# EAGLE schematic EngineeringModelBoard (EAGLE 7.3.0)

## Sheet 1 of 7: µC and Programming
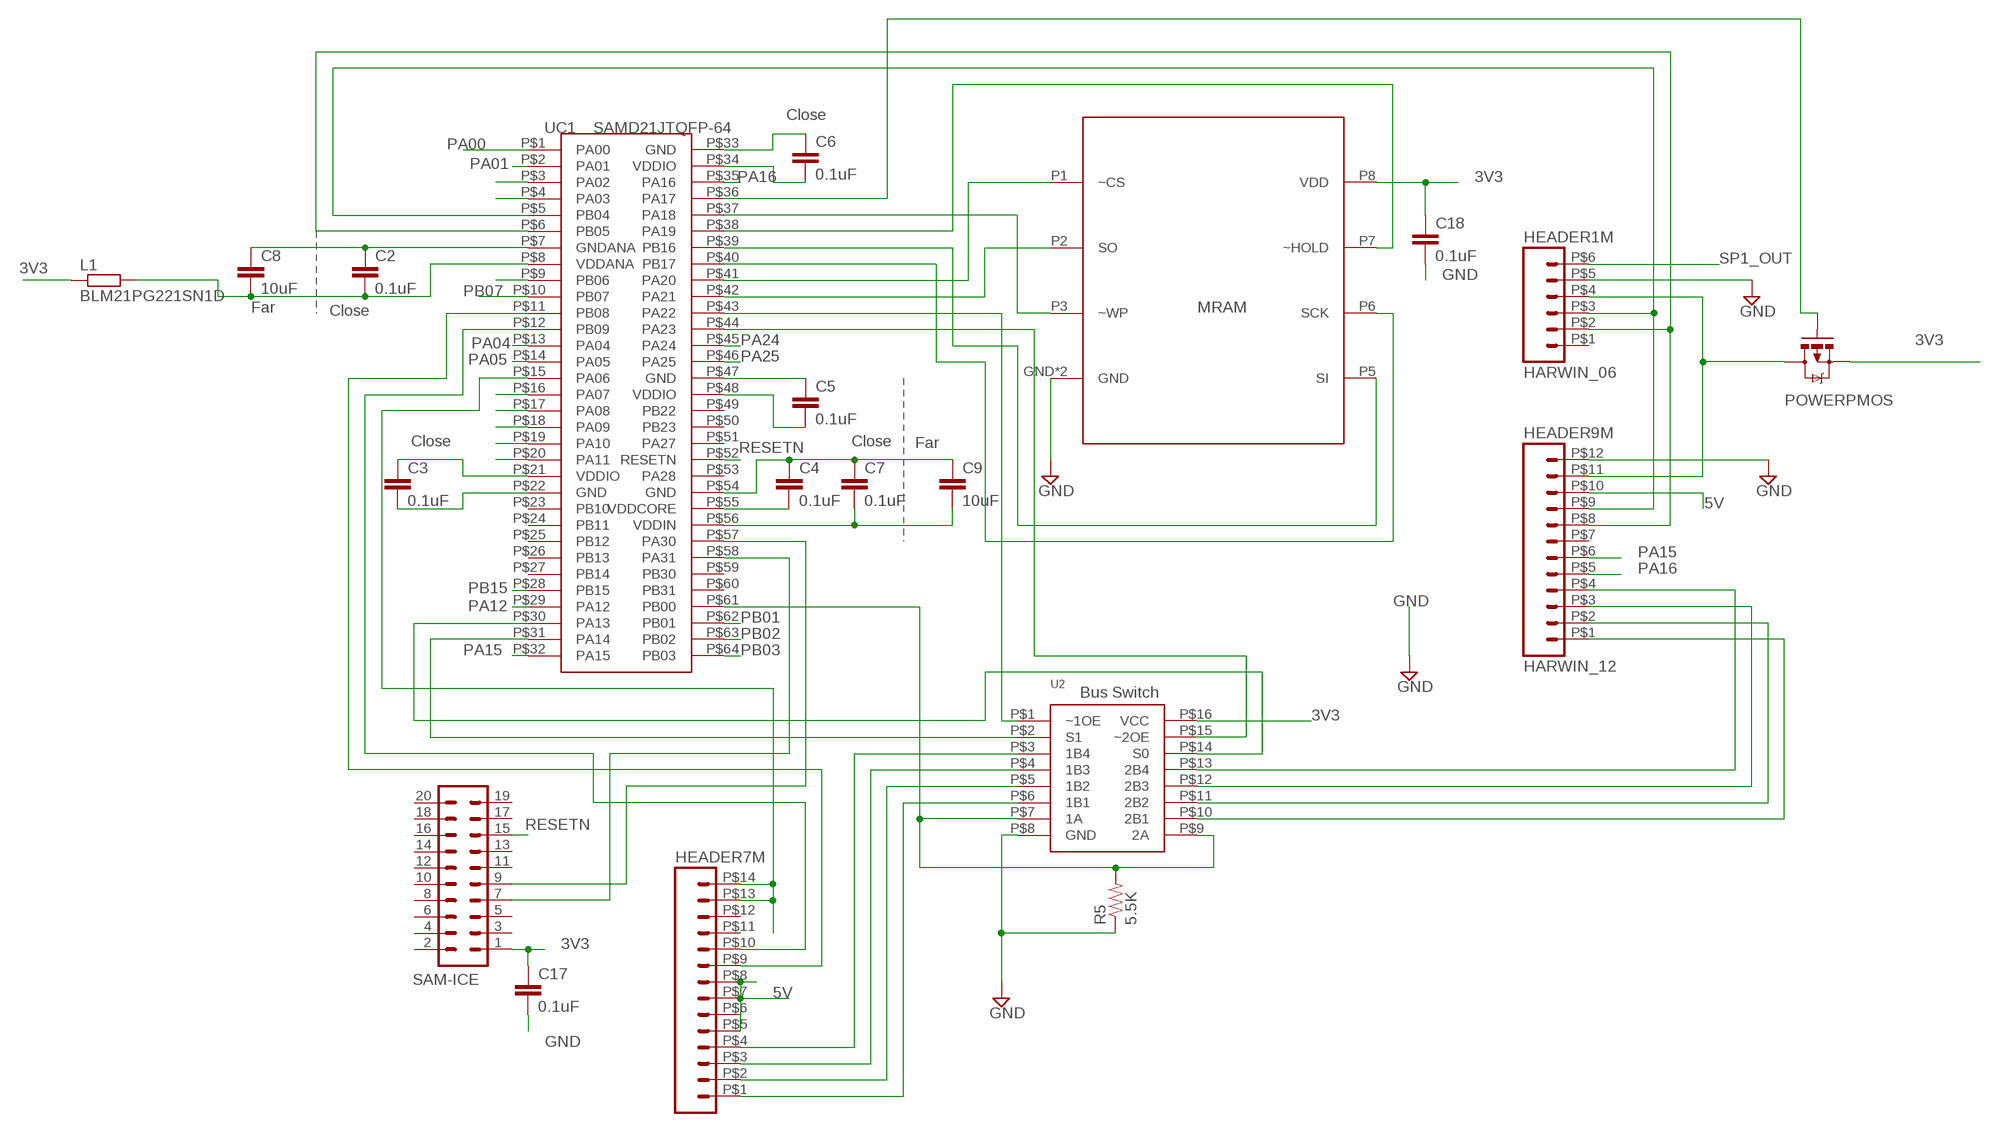
[diagram p0: schematic, sheet 1]

### Parts
C2  0.1uF  CAP0805  [0805]
C3  0.1uF  CAP0805  [0805]
C4  0.1uF  CAP0805  [0805]
C5  0.1uF  CAP0805  [0805]
C6  0.1uF  CAP0805  [0805]
C7  0.1uF  CAP0805  [0805]
C8  10uF  CAP0805  [0805]
C9  10uF  CAP0805  [0805]
C17  0.1uF  CAP0805  [0805]
C18  0.1uF  CAP0805  [0805]
HEADER1M  HARWIN_06  [HARWIN_DATAMATE_6]
HEADER7M  HARWIN_14  [HARWIN_DATAMATE_14]
HEADER9M  HARWIN_12  [HARWIN_DATAMATE_12]
L1  BLM21PG221SN1D  R-EU_R0805  [R0805]
R5  5.5K  RESISTOR  [0805]
SAM-ICE  IDC_JTAG_CONNECTOR  [2X10]
U2  SN74CBTLV3253  [SOIC16R]
U$3  MRAM  MR25H10CDC  [8PXMO-229]
U$14  POWERPMOS  [SO08]
UC1  SAMD21JTQFP-64  [TQFP-64]

### Nets
3V3 [3V3]: C3.1 C5.2 C6.2 C7.2 C9.2 C17.1 C18.1 L1.1 SAM-ICE.1 U2.P$16(VCC) U$3.P8(VDD) U$14.1(S) U$14.2(S) U$14.3(S) UC1.P$21(VDDIO) UC1.P$34(VDDIO) UC1.P$48(VDDIO) UC1.P$56(VDDIN) ; also sheet 4,5
3V3D [3V3]: HEADER1M.P$4 HEADER9M.P$11 U$14.5(D) U$14.6(D) U$14.7(D) U$14.8(D)
5V [5V]: HEADER7M.P$5 HEADER7M.P$6 HEADER7M.P$7 HEADER7M.P$8 HEADER9M.P$10 ; also sheet 4
GND [GND]: C2.1 C4.1 C5.1 C6.1 C7.1 C8.1 C9.1 C17.2 C18.2 HEADER1M.P$5 HEADER9M.P$12 R5.1 U2.P$8(GND) U$3.GND U$3.P4(GND) UC1.P$7(GNDANA) UC1.P$33(GND) UC1.P$47(GND) UC1.P$54(GND) ; also sheet 4,5,6
N$16: U$3.P1(~CS) UC1.P$41(PA20)
N$18: U$3.P2(SO) UC1.P$42(PA21)
N$19: U$3.P3(~WP) UC1.P$37(PA18)
N$20: HEADER9M.P$1 U2.P$10(2B1)
N$21: HEADER9M.P$2 U2.P$11(2B2)
N$22: HEADER9M.P$3 U2.P$12(2B3)
N$23: HEADER9M.P$4 U2.P$13(2B4)
N$24: HEADER7M.P$1 U2.P$6(1B1)
N$25: HEADER7M.P$2 U2.P$5(1B2)
N$26: HEADER7M.P$3 U2.P$4(1B3)
N$27: HEADER7M.P$4 U2.P$3(1B4)
N$28: U2.P$14(S0) UC1.P$30(PA13)
N$29: U2.P$2(S1) UC1.P$31(PA14)
N$30: U2.P$1(~1OE) UC1.P$43(PA22)
N$31: U2.P$15(~2OE) UC1.P$44(PA23)
N$34: U$3.P7(~HOLD) UC1.P$38(PA19)
N$35: U$3.P6(SCK) UC1.P$40(PB17)
N$41: C3.2 UC1.P$22(GND)
N$42: U$3.P5(SI) UC1.P$39(PB16)
N$43: C2.2 C8.2 L1.2 UC1.P$8(VDDANA)
N$47: C4.2 UC1.P$55(VDDCORE)
N$72: U$14.4(G) UC1.P$36(PA17)
PA00: UC1.P$1(PA00) ; also sheet 5
PA01: UC1.P$2(PA01) ; also sheet 5
PA02: UC1.P$3(PA02)
PA03: UC1.P$4(PA03)
PA04: UC1.P$13(PA04) ; also sheet 5
PA05: UC1.P$14(PA05) ; also sheet 5
PA06: HEADER7M.P$13 HEADER7M.P$14 UC1.P$15(PA06)
PA07: UC1.P$16(PA07)
PA08: UC1.P$17(PA08)
PA09: UC1.P$18(PA09)
PA10: UC1.P$19(PA10)
PA11: UC1.P$20(PA11)
PA12: UC1.P$29(PA12) ; also sheet 5
PA15: HEADER9M.P$6 UC1.P$32(PA15)
PA16: HEADER9M.P$5 UC1.P$35(PA16)
PA24: UC1.P$45(PA24) ; also sheet 6
PA25: UC1.P$46(PA25) ; also sheet 6
PA30: SAM-ICE.9 UC1.P$57(PA30)
PA31: SAM-ICE.7 UC1.P$58(PA31)
PB00: R5.2 U2.P$7(1A) U2.P$9(2A) UC1.P$61(PB00)
PB01: UC1.P$62(PB01) ; also sheet 6
PB02: UC1.P$63(PB02) ; also sheet 6
PB03: UC1.P$64(PB03) ; also sheet 6
PB04: HEADER1M.P$3 HEADER9M.P$9 UC1.P$5(PB04)
PB05: HEADER1M.P$2 HEADER9M.P$8 UC1.P$6(PB05)
PB06: UC1.P$9(PB06)
PB07: UC1.P$10(PB07) ; also sheet 4
PB08: HEADER7M.P$9 UC1.P$11(PB08)
PB09: HEADER7M.P$10 UC1.P$12(PB09)
PB15: UC1.P$28(PB15) ; also sheet 5
RESETN: SAM-ICE.15 UC1.P$52(RESETN)
SP1_OUT: HEADER1M.P$6
Unconnected: HEADER1M.P$1 HEADER7M.P$11 HEADER7M.P$12 HEADER9M.P$7 SAM-ICE.2 SAM-ICE.3 SAM-ICE.4 SAM-ICE.5 SAM-ICE.6 SAM-ICE.8 SAM-ICE.10 SAM-ICE.11 SAM-ICE.12 SAM-ICE.13 SAM-ICE.14 SAM-ICE.16 SAM-ICE.17 SAM-ICE.18 SAM-ICE.19 SAM-ICE.20 UC1.P$23(PB10) UC1.P$24(PB11) UC1.P$25(PB12) UC1.P$26(PB13) UC1.P$27(PB14) UC1.P$49(PB22) UC1.P$50(PB23) UC1.P$51(PA27) UC1.P$53(PA28) UC1.P$59(PB30) UC1.P$60(PB31)

### Notes on the sheet
- Close
- Far | Close | MRAM
- Close | Close | Far
- Bus Switch

## Sheet 2 of 7: Flash Panel
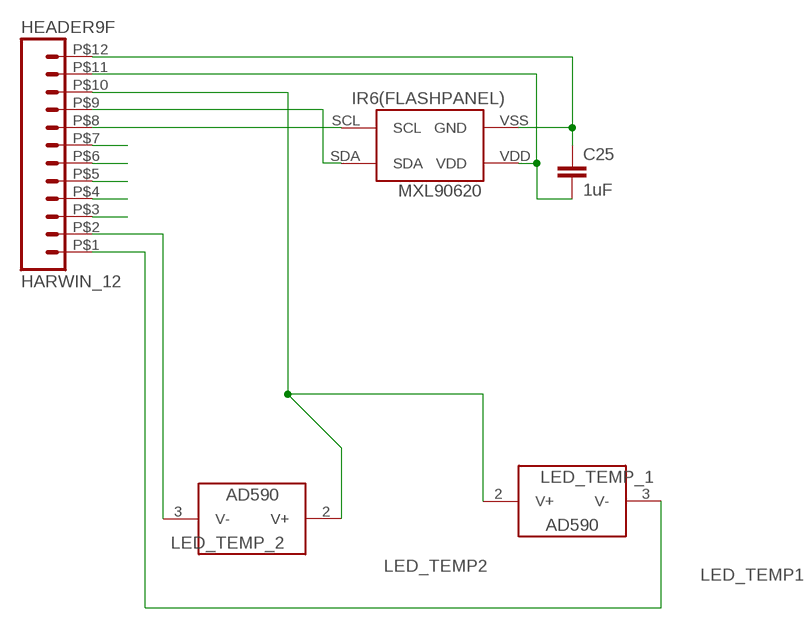
[diagram p1: schematic, sheet 2]

### Parts
C25  1uF  CAP0805  [0805]
HEADER9F  HARWIN_12  [HARWIN_DATAMATE_12]
IR6(FLASHPANEL)  MXL90620  [MXL90620]
LED_TEMP_1  AD590-SOIC-8  [8SOIC]
LED_TEMP_2  AD590-SOIC-8  [8SOIC]

### Nets
3V3IR: C25.2 HEADER9F.P$11 IR6(FLASHPANEL).VDD
GNDIR: C25.1 HEADER9F.P$12 IR6(FLASHPANEL).VSS(GND)
H9.1: HEADER9F.P$1 LED_TEMP_1.3(V-)
H9.2: HEADER9F.P$2 LED_TEMP_2.3(V-)
H9.3: HEADER9F.P$3
H9.4: HEADER9F.P$4
H9.5: HEADER9F.P$5
H9.6: HEADER9F.P$6
H9.7: HEADER9F.P$7
H9.10: HEADER9F.P$10 LED_TEMP_1.2(V+) LED_TEMP_2.2(V+)
SCLIR: HEADER9F.P$8 IR6(FLASHPANEL).SCL
SDAIR: HEADER9F.P$9 IR6(FLASHPANEL).SDA

### Notes on the sheet
- LED_TEMP2
- LED_TEMP1

## Sheet 3 of 7: Side 1
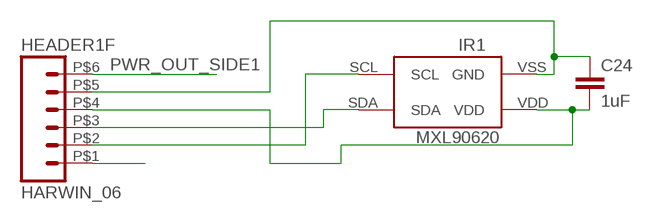
[diagram p2: schematic, sheet 3]

### Parts
C24  1uF  CAP0805  [0805]
HEADER1F  HARWIN_06  [HARWIN_DATAMATE_6]
IR1  MXL90620  [MXL90620]

### Nets
H1.1: HEADER1F.P$1
H1.2: HEADER1F.P$2 IR1.SCL
H1.3: HEADER1F.P$3 IR1.SDA
H1.4: C24.2 HEADER1F.P$4 IR1.VDD
H1.5: C24.1 HEADER1F.P$5 IR1.VSS(GND)
PWR_OUT_SIDE1: HEADER1F.P$6

## Sheet 4 of 7: Power Regulation
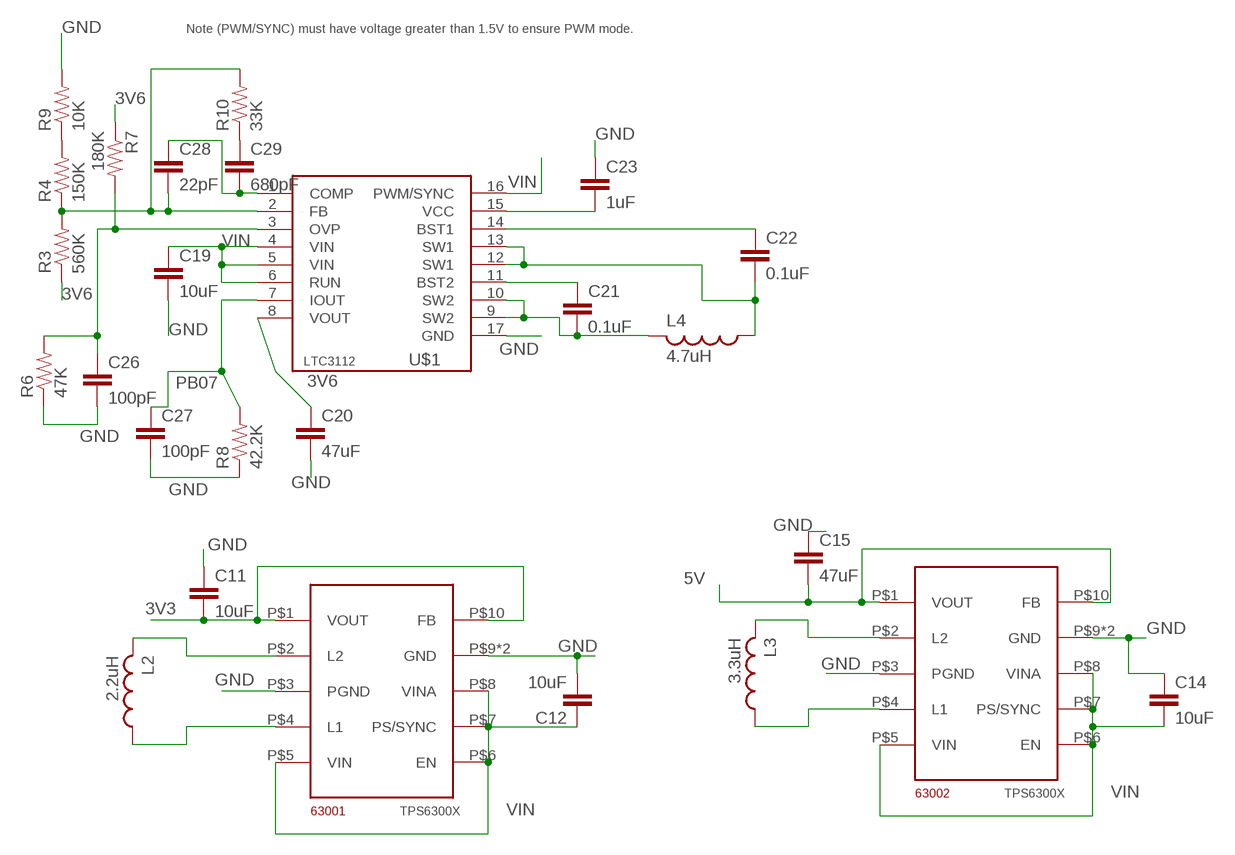
[diagram p3: schematic, sheet 4]

### Parts
63001  TPS6300X  [QFN10_POWERPAD]
63002  TPS6300X  [QFN10_POWERPAD]
C11  10uF  CAP0603-CAP  [0603-CAP]
C12  10uF  CAP0603-CAP  [0603-CAP]
C14  10uF  CAP0603-CAP  [0603-CAP]
C15  47uF  CAP0603-CAP  [0603-CAP]
C19  10uF  CAP0603-CAP  [0603-CAP]
C20  47uF  CAP0805  [0805]
C21  0.1uF  CAP0603-CAP  [0603-CAP]
C22  0.1uF  CAP0603-CAP  [0603-CAP]
C23  1uF  CAP0603-CAP  [0603-CAP]
C26  100pF  CAP0805  [0805]
C27  100pF  CAP0805  [0805]
C28  22pF  CAP0805  [0805]
C29  680pF  CAP0805  [0805]
L2  2.2uH  L-USL3225M  [L3225M]
L3  3.3uH  L-USL3225M  [L3225M]
L4  4.7uH  L-USL3225M  [L3225M]
R3  560K  RESISTOR  [0805]
R4  150K  RESISTOR  [0805]
R6  47K  RESISTOR  [0805]
R7  180K  RESISTOR  [0805]
R8  42.2K  RESISTOR  [0805]
R9  10K  RESISTOR  [0805]
R10  33K  RESISTOR  [0805]
U$1  LTC3112  [DHD16]

### Nets
3V3 [3V3]: 63001.P$1(VOUT) 63001.P$10(FB) C11.2 ; also sheet 1,5
3V6 [3V6]: C20.1 R3.1 R7.1 U$1.8(VOUT) ; also sheet 6
5V [5V]: 63002.P$1(VOUT) 63002.P$10(FB) C15.2 ; also sheet 1
GND [GND]: 63001.P$3(PGND) 63001.P$9(GND) 63001.PAD(GND) 63002.P$3(PGND) 63002.P$9(GND) 63002.PAD(GND) C11.1 C12.2 C14.1 C15.1 C19.2 C20.2 C23.1 C26.2 C27.2 R6.1 R8.1 R9.2 U$1.17(GND) ; also sheet 1,5,6
N$3: C21.1 U$1.11(BST2)
N$4: C22.1 U$1.14(BST1)
N$5: C23.2 U$1.15(VCC)
N$40: C22.2 L4.1 U$1.12(SW1) U$1.13(SW1)
N$45: 63002.P$2(L2) L3.2
N$46: 63002.P$4(L1) L3.1
N$48: 63001.P$2(L2) L2.2
N$50: 63001.P$4(L1) L2.1
N$53: C21.2 L4.2 U$1.9(SW2) U$1.10(SW2)
N$54: C28.2 R3.2 R4.1 R10.2 U$1.2(FB)
N$69: C26.1 R6.2 R7.2 U$1.3(OVP)
N$70: C29.1 R10.1
N$71: C28.1 C29.2 U$1.1(COMP)
N$999: R4.2 R9.1
PB07: C27.1 R8.2 U$1.7(IOUT) ; also sheet 1
VIN: 63001.P$5(VIN) 63001.P$6(EN) 63001.P$7(PS/SYNC) 63001.P$8(VINA) 63002.P$5(VIN) 63002.P$6(EN) 63002.P$7(PS/SYNC) 63002.P$8(VINA) C12.1 C14.2 C19.1 U$1.4(VIN) U$1.5(VIN) U$1.6(RUN) U$1.16(PWM/SYNC) ; also sheet 5

### Notes on the sheet
- Note (PWM/SYNC) must have voltage greater than 1.5V to ensure PWM mode.

## Sheet 5 of 7: Sensors
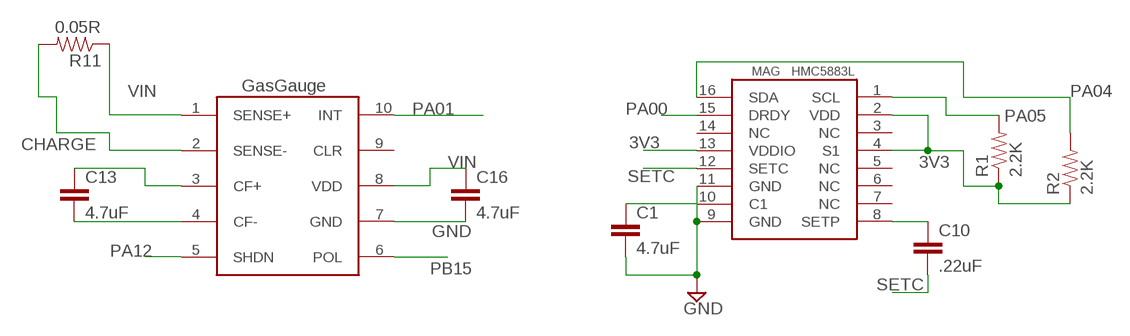
[diagram p4: schematic, sheet 5]

### Parts
C1  4.7uF  CAP0805  [0805]
C10  .22uF  CAP0805  [0805]
C13  4.7uF  CAP0805  [0805]
C16  4.7uF  CAP0805  [0805]
MAG  HMC5883L  [HMC5883L]
R1  2.2K  RESISTOR  [0805]
R2  2.2K  RESISTOR  [0805]
R11  0.05R  RESISTOR  [0805]
U$2  LTC4150  [MSOP10]

### Nets
3V3 [3V3]: MAG.2(VDD) MAG.4(S1) MAG.13(VDDIO) R1.1 R2.1 ; also sheet 1,4
CHARGE: R11.2 U$2.2(SENSE-)
GND [GND]: C1.2 C16.2 MAG.9(GND) MAG.11(GND) U$2.7(GND) ; also sheet 1,4,6
N$1: C1.1 MAG.10(C1)
N$36: C10.1 MAG.8(SETP)
N$57: C13.1 U$2.3(CF+)
N$58: C13.2 U$2.4(CF-)
PA00: MAG.15(DRDY) ; also sheet 1
PA01: U$2.10(INT) ; also sheet 1
PA04: MAG.16(SDA) R2.2 ; also sheet 1
PA05: MAG.1(SCL) R1.2 ; also sheet 1
PA12: U$2.5(SHDN) ; also sheet 1
PB15: U$2.6(POL) ; also sheet 1
SETC: C10.2 MAG.12(SETC)
VIN: C16.1 R11.1 U$2.1(SENSE+) U$2.8(VDD) ; also sheet 4
Unconnected: MAG.3(NC) MAG.5(NC) MAG.6(NC) MAG.7(NC) MAG.14(NC) U$2.9(CLR)

### Notes on the sheet
- GasGauge

## Sheet 6 of 7: Radio
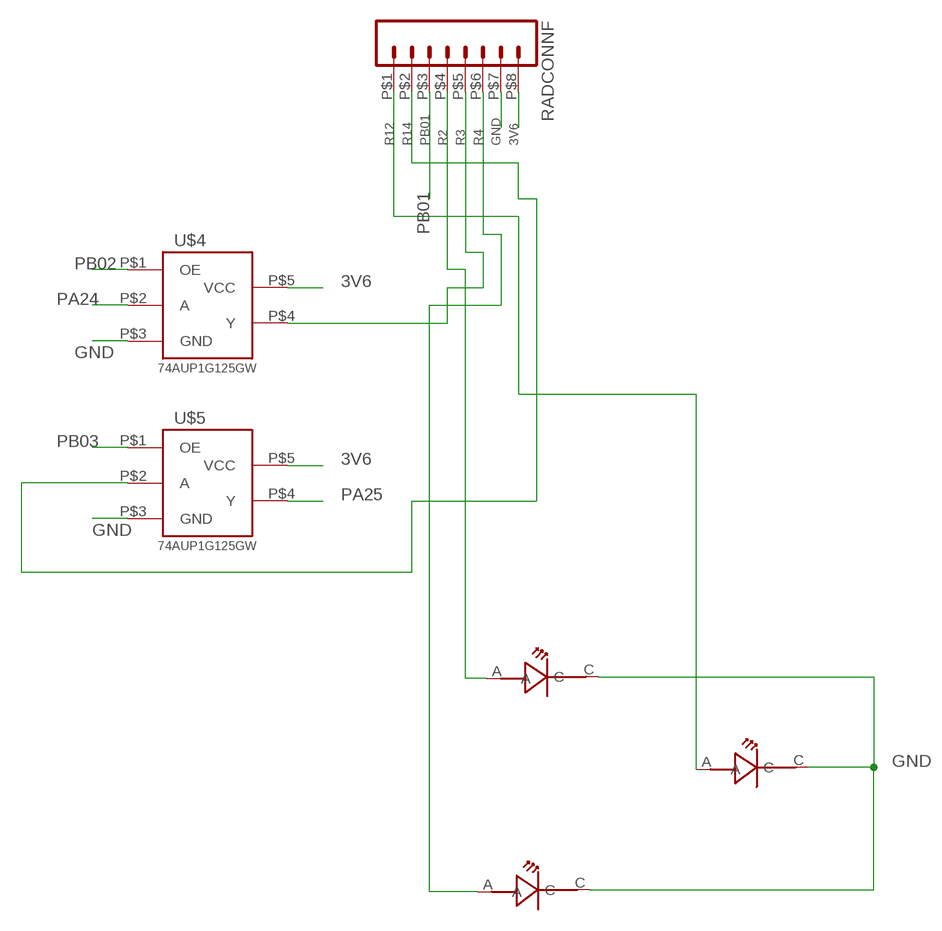
[diagram p5: schematic, sheet 6]

### Parts
RADCONNF  HARWIN_08  [HARWIN_DATAMATE_08]
U$4  74AUP1G125GW  [TSSOP-5]
U$5  74AUP1G125GW  [TSSOP-5]
U$11  LT-T673-Q1R2-25-Z  [PLCC-2]
U$12  LT-T673-Q1R2-25-Z  [PLCC-2]
U$13  LT-T673-Q1R2-25-Z  [PLCC-2]

### Nets
3V6 [3V6]: RADCONNF.P$8 U$4.P$5(VCC) U$5.P$5(VCC) ; also sheet 4
GND [GND]: RADCONNF.P$7 U$4.P$3(GND) U$5.P$3(GND) U$11.C U$12.C U$13.C ; also sheet 1,4,5
PA24: U$4.P$2(A) ; also sheet 1
PA25: U$5.P$4(Y) ; also sheet 1
PB01: RADCONNF.P$3 ; also sheet 1
PB02: U$4.P$1(OE) ; also sheet 1
PB03: U$5.P$1(OE) ; also sheet 1
R2: RADCONNF.P$4 U$13.A
R3: RADCONNF.P$5 U$4.P$4(Y)
R4: RADCONNF.P$6 U$12.A
R12: RADCONNF.P$1 U$11.A
R14: RADCONNF.P$2 U$5.P$2(A)

## Sheet 7 of 7: Batteries
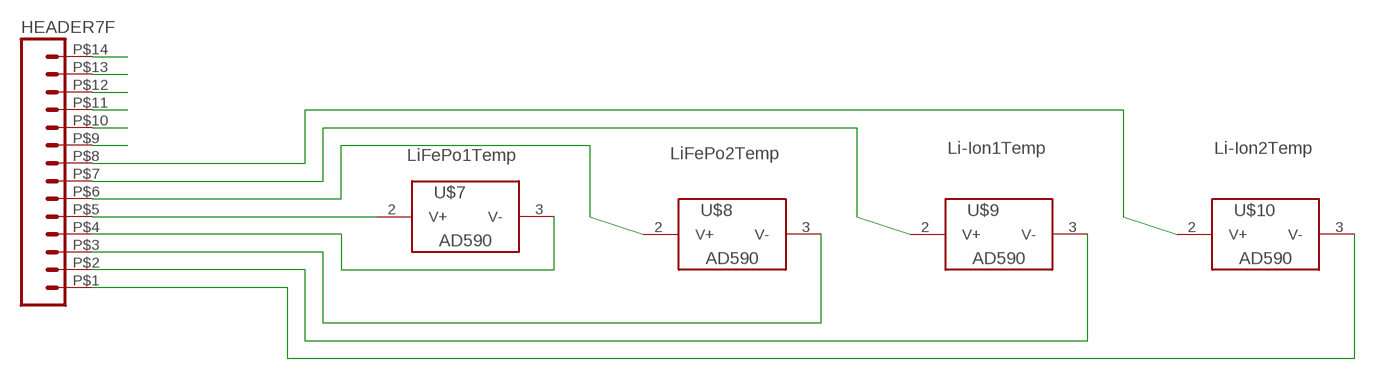
[diagram p6: schematic, sheet 7]

### Parts
HEADER7F  HARWIN_14  [HARWIN_DATAMATE_14]
U$7  AD590-SOIC-8  [8SOIC]
U$8  AD590-SOIC-8  [8SOIC]
U$9  AD590-SOIC-8  [8SOIC]
U$10  AD590-SOIC-8  [8SOIC]

### Nets
H7.1: HEADER7F.P$1 U$10.3(V-)
H7.2: HEADER7F.P$2 U$9.3(V-)
H7.3: HEADER7F.P$3 U$8.3(V-)
H7.4: HEADER7F.P$4 U$7.3(V-)
H7.5: HEADER7F.P$5 U$7.2(V+)
H7.6: HEADER7F.P$6 U$8.2(V+)
H7.7: HEADER7F.P$7 U$9.2(V+)
H7.8: HEADER7F.P$8 U$10.2(V+)
H7.9: HEADER7F.P$9
H7.10: HEADER7F.P$10
H7.11: HEADER7F.P$11
H7.12: HEADER7F.P$12
H7.13: HEADER7F.P$13
H7.14: HEADER7F.P$14

### Notes on the sheet
- Li-Ion1Temp | Li-Ion2Temp
- LiFePo1Temp | LiFePo2Temp

## Library data of the parts
63001 63002 = CNTRL_BOARD:TPS6300X; OC_NEWARK: unknown
C1 C13 C16 = CNTRL_BOARD:CAP: Capacitor Standard 0603 ceramic capacitor, and 0.1" leaded capacitor.; MF: AVX CORPORATION; MPN: 08056D475KAT2A; OC_NEWARK: 84K8400
C2-C7 C17 C18 C21 C22 = CNTRL_BOARD:CAP: Capacitor Standard 0603 ceramic capacitor, and 0.1" leaded capacitor.; MPN: 0603YC104JAT2A; OC_NEWARK: 96M1175
C8 C9 = CNTRL_BOARD:CAP: Capacitor Standard 0603 ceramic capacitor, and 0.1" leaded capacitor.; MF: AVX CORPORATION; MPN: 08056D106KAT2A; OC_NEWARK: 84K8398
C10 = CNTRL_BOARD:CAP: Capacitor Standard 0603 ceramic capacitor, and 0.1" leaded capacitor.; MF: AVX CORPORATION; MPN: 08053C224KAT2A; OC_NEWARK: 96K4775
C11 C12 C19 C23 = CNTRL_BOARD:CAP: Capacitor Standard 0603 ceramic capacitor, and 0.1" leaded capacitor.; OC_NEWARK: unknown
C14 = CNTRL_BOARD:CAP: Capacitor Standard 0603 ceramic capacitor, and 0.1" leaded capacitor.; MPN: C1608X5R1A225K080AC; OC_NEWARK: 04X3244
C15 C20 = CNTRL_BOARD:CAP: Capacitor Standard 0603 ceramic capacitor, and 0.1" leaded capacitor.; MPN: EMK107B7474KA-T; OC_NEWARK: 77M8434
C24 C25 = CNTRL_BOARD:CAP: Capacitor Standard 0603 ceramic capacitor, and 0.1" leaded capacitor.; MPN: 0805ZC105KAT2A; OC_NEWARK: 96M1308
C26 C27 = CNTRL_BOARD:CAP: Capacitor Standard 0603 ceramic capacitor, and 0.1" leaded capacitor.; MF: AVX CORPORATION; MPN: 08051A101J4T4A; OC_NEWARK: 55J5675
C28 = CNTRL_BOARD:CAP: Capacitor Standard 0603 ceramic capacitor, and 0.1" leaded capacitor.; MF: AVX CORPORATION; MPN: 08051A220JAT2A; OC_NEWARK: 96K4769
C29 = CNTRL_BOARD:CAP: Capacitor Standard 0603 ceramic capacitor, and 0.1" leaded capacitor.; MPN: 08055C681KAT2A; OC_NEWARK: 94W2947
HEADER1F HEADER1M = CNTRL_BOARD:HARWIN_06; OC_NEWARK: unknown
HEADER7F HEADER7M = CNTRL_BOARD:HARWIN_14; OC_NEWARK: unknown
HEADER9F HEADER9M = CNTRL_BOARD:HARWIN_12; OC_NEWARK: unknown
IR1 IR6(FLASHPANEL) = CNTRL_BOARD:MXL90620; OC_NEWARK: unknown
L1 = rcl:R-EU_: RESISTOR, European symbol; MPN: BLM21PG221SN1D; OC_NEWARK: 73M9167
L2 L4 = resistor:L-US: INDUCTOR, American symbol; OC_NEWARK: unknown
L3 = resistor:L-US: INDUCTOR, American symbol; MPN: JMK212BJ335KG-T; OC_NEWARK: 08P5148
LED_TEMP_1 LED_TEMP_2 U$7-U$10 = CNTRL_BOARD:AD590-SOIC-8; MPN: AD590JRZ; OC_NEWARK: 29M8422
MAG = CNTRL_BOARD:HMC5883L; MPN: HMC5883L-TR; OC_NEWARK: 20T0699
R1 R2 = CNTRL_BOARD:RESISTOR; MPN: SR1-0805-222; OC_NEWARK: 33C6600
R3 = CNTRL_BOARD:RESISTOR; MPN: MC01W08051560K; OC_NEWARK: 94W6326
R4-R6 R8-R11 = CNTRL_BOARD:RESISTOR; OC_NEWARK: unknown
R7 = CNTRL_BOARD:RESISTOR; MPN: ERJ-6GEYJ184V; OC_NEWARK: 53W4944
RADCONNF = CNTRL_BOARD:HARWIN_08; OC_NEWARK: unknown
SAM-ICE = CNTRL_BOARD:IDC_JTAG_CONNECTOR; OC_NEWARK: unknown
U2 = CNTRL_BOARD:SN74CBTLV3253; OC_NEWARK: unknown
U$1 = CNTRL_BOARD:LTC3112; MPN: LTC3112EFE#PBF; OC_NEWARK: 24T2752
U$2 = linear-technology:LTC4150; MPN: LTC4150CMS#PBF; OC_NEWARK: 56M8728
U$3 = mram:MR25H10CDC; OC_NEWARK: unknown
U$4 U$5 = CNTRL_BOARD:74AUP1G125GW; MPN: 74AUP1G125GW; OC_NEWARK: 55W4620
U$11-U$13 = CNTRL_BOARD:LT-T673-Q1R2-25-Z; OC_NEWARK: unknown
U$14 = CNTRL_BOARD:POWERPMOS; OC_NEWARK: unknown
UC1 = SAMD21J:SAMD21J; OC_NEWARK: unknown

## Net classes
0 default: width 0.203 mm, drill 0.203 mm, clearance 0.203 mm
1 GND: width 0.508 mm, drill 0.254 mm, clearance 0.305 mm
2 3V3: width 0.508 mm, drill 0.254 mm, clearance 0.305 mm
3 3V6: width 1.016 mm, drill 0.254 mm, clearance 0.305 mm
4 5V: width 0.508 mm, drill 0.254 mm, clearance 0.305 mm